# Altium schematic sheet [09] - DISPLAY.SchDoc
size A4; DocumentNumber: 9; SheetNumber: 9; SheetTotal: 14
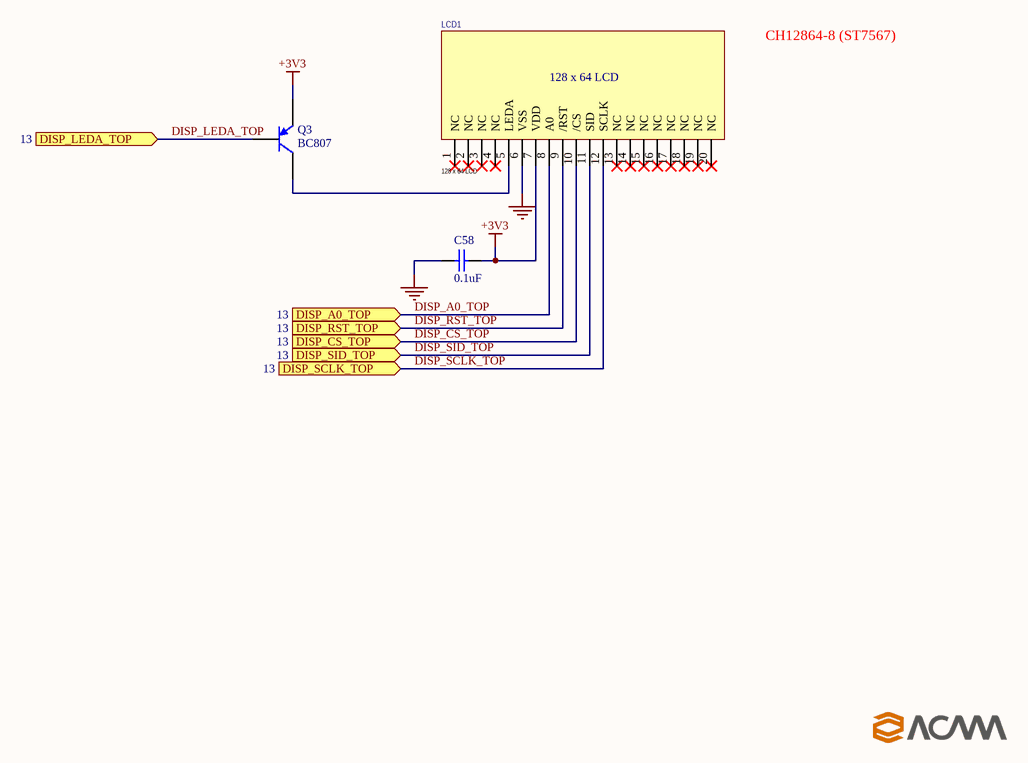
[diagram p0: [09] - DISPLAY.SchDoc]

## Parts
C58  0.1uF  [0805_C_AUTO]
LCD1  128 x 64 LCD  [LCD_128x64]
Q3  BC807  [SOT23]

## Ports
DISP_A0_TOP (in, see 13), DISP_CS_TOP (in, see 13), DISP_LEDA_TOP (in, see 13), DISP_RST_TOP (in, see 13), DISP_SCLK_TOP (in, see 13), DISP_SID_TOP (in, see 13)

## Nets
+3V3: C58.1 LCD1.7(VDD) Q3.2(E)
GND: C58.2 LCD1.6(VSS)
DISP_A0_TOP: LCD1.8(A0) ; port DISP_A0_TOP
DISP_CS_TOP: LCD1.10(/CS) ; port DISP_CS_TOP
DISP_LEDA_TOP: Q3.1(B) ; port DISP_LEDA_TOP
DISP_RST_TOP: LCD1.9(/RST) ; port DISP_RST_TOP
DISP_SCLK_TOP: LCD1.12(SCLK) ; port DISP_SCLK_TOP
DISP_SID_TOP: LCD1.11(SID) ; port DISP_SID_TOP
NetLCD1_5: LCD1.5(LEDA) Q3.3(C)

Not connected (* = marked no-connect by the designer): LCD1 1(NC)* 2(NC)* 3(NC)* 4(NC)* 13(NC)* 14(NC)* 15(NC)* 16(NC)* 17(NC)* 18(NC)* 19(NC)* 20(NC)*

## Notes on the sheet
- CH12864-8 (ST7567)

## Library data of the parts
C58 = Cap SMD: Non-Pol SMD Capacitor; RATED_VOLTAGE: 16V; Value: 0.1uF; Manufacturer Part Num: *
LCD1 = LCD 128x64: Chiness 128 x 64 LCD; Value: 128 x 64 LCD
Q3 = Transistor PNP: PNP General Purpose Transistor; Value: BC807